# Altium project LightSensor_SWS.PrjPcb
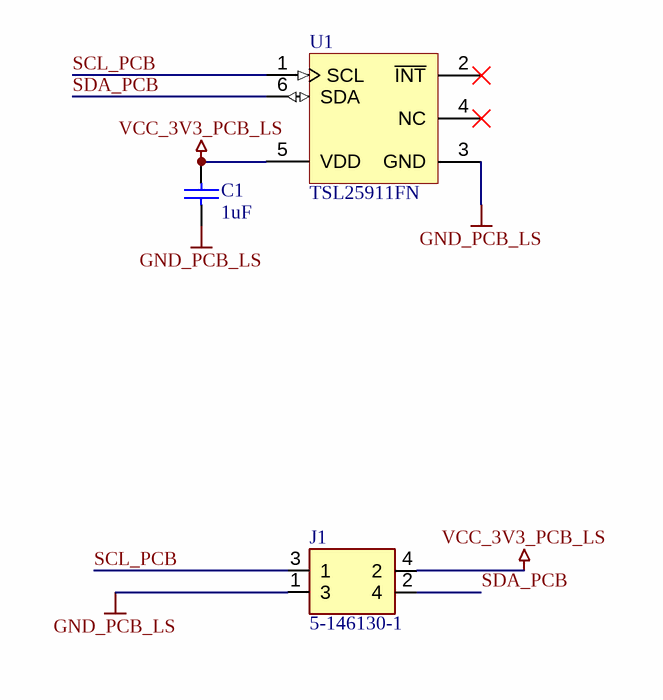
[diagram p0: LightSensor_PCB.SchDoc]
1 sheet, 3 parts. Net scope: global (net labels, ports and power ports of the same name join across sheets).
Board file: LightSensor.PcbDoc

## Sheet LightSensor_PCB.SchDoc: LightSensor_PCB
size A3; DrawnBy: FeKunz; Revision: 1; SheetNumber: 1; SheetTotal: 1

### Parts
C1  1uF  [CAPC2013X135X45LL10T25]
J1  5-146130-1  [TE_5-146130-1]
U1  TSL25911FN  [AMS-FN-6-2400X2000DE_V]

### Nets
GND_PCB_LS: C1.2 J1.1(3) U1.3(GND)
VCC_3V3_PCB_LS: C1.1 J1.4(2) U1.5(VDD)
SCL_PCB: J1.3(1) U1.1(SCL)
SDA_PCB: J1.2(4) U1.6(SDA)

Not connected (* = marked no-connect by the designer): U1 2(~{INT})* 4(NC)*

### Notes on the sheet
- Project:
- Drawn by:
- Size:
- Sheet
- A3
- Rev.:
- of
- Date:
- File:

### Library data of the parts
C1 = CMP-1036-04761-2: Manufacturer: Murata; Part Number: GRM21BR71H105KA12L
J1 = 5-146130-1: AMPMODU 4 Position Surface Mount Dual Row Straight 2.54 mm Breakaway Header; MF: {'manufacturer': u'TE Connectivity'}; Price: None; Package: None; Availability: Unavailable; Value: *; MP: 5-146130-1
U1 = CMP-0865-00001-1: Light-to-Digital Converter with I2C Interface, 2.7 to 3.6 V, -30 to 70 degC, FN-6, Pb-Free, Reel; Manufacturer: AMS; Interface: I2C - Vdd; Supply Voltage (V): 2.7 - 3.6; Maximum Lux: 88K; Programmable: Gain, Integration Time, Interrupt; ComponentLink2Description: Datasheet; ComponentLink1URL: www.ams.com; Mounting Technology: Surface Mount; PackageReference: FN-6; PackageVersion: TAOS059Q, 11/2009; ComponentLink2URL: http://www.ams.com/eng/content/download/389383/1251117/221235; PartNumber: TSL25911FN; PackageDescription: 6-Pin Dual Flat No-Lead, 2.4 x 2 mm Body, 0.65 mm Pitch; ComponentLink1Description: Manufacturer URL